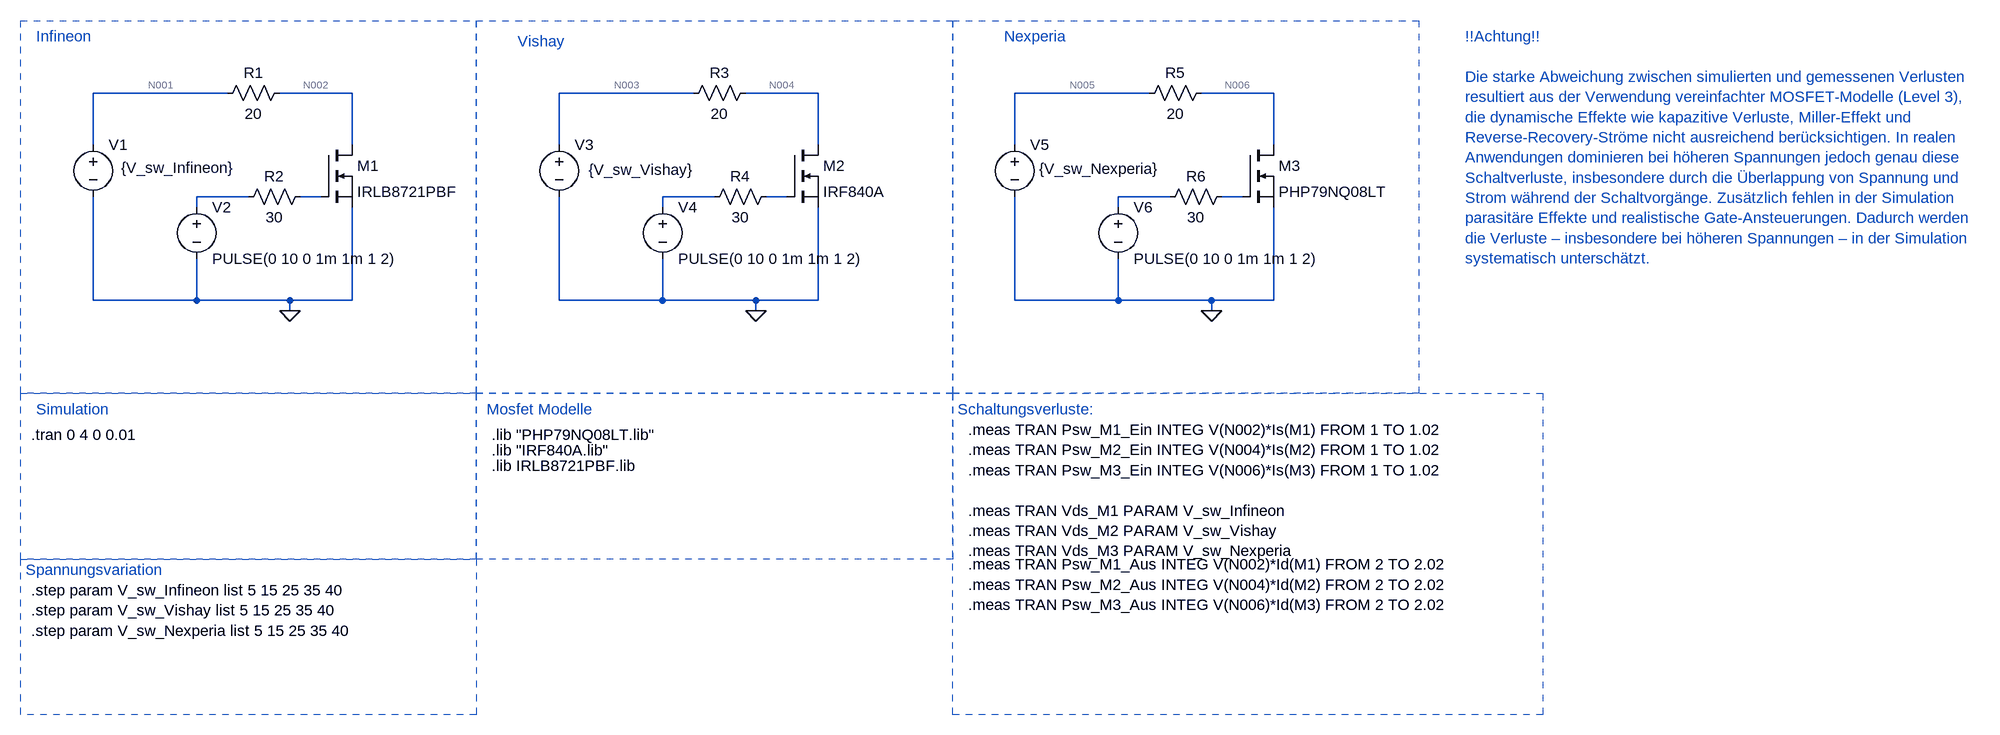
[diagram p0: schematic Messprojekt.asc]
Messprojekt.asc, the LTspice schematic file:
Version 4
SHEET 1 9504 1040
WIRE -208 -192 -416 -192
WIRE -16 -192 -128 -192
WIRE 512 -192 304 -192
WIRE 704 -192 592 -192
WIRE 1216 -192 1008 -192
WIRE 1408 -192 1296 -192
WIRE -416 -112 -416 -192
WIRE -16 -112 -16 -192
WIRE 304 -112 304 -192
WIRE 704 -112 704 -192
WIRE 1008 -112 1008 -192
WIRE 1408 -112 1408 -192
WIRE -176 -32 -256 -32
WIRE -64 -32 -96 -32
WIRE 544 -32 464 -32
WIRE 656 -32 624 -32
WIRE 1248 -32 1168 -32
WIRE 1360 -32 1328 -32
WIRE -256 -16 -256 -32
WIRE 464 -16 464 -32
WIRE 1168 -16 1168 -32
WIRE -416 128 -416 -32
WIRE -256 128 -256 64
WIRE -256 128 -416 128
WIRE -112 128 -256 128
WIRE -16 128 -16 -16
WIRE -16 128 -112 128
WIRE 304 128 304 -32
WIRE 464 128 464 64
WIRE 464 128 304 128
WIRE 608 128 464 128
WIRE 704 128 704 -16
WIRE 704 128 608 128
WIRE 1008 128 1008 -32
WIRE 1168 128 1168 64
WIRE 1168 128 1008 128
WIRE 1312 128 1168 128
WIRE 1408 128 1408 -16
WIRE 1408 128 1312 128
WIRE -112 144 -112 128
WIRE 608 144 608 128
WIRE 1312 144 1312 128
FLAG -112 144 0
FLAG 608 144 0
FLAG 1312 144 0
SYMBOL nmos -64 -112 R0
SYMATTR InstName M1
SYMATTR Value IRLB8721PBF
SYMBOL voltage -416 -128 R0
WINDOW 123 0 0 Left 0
WINDOW 39 0 0 Left 0
WINDOW 3 43 51 Left 2
SYMATTR Value {V_sw_Infineon}
SYMATTR InstName V1
SYMBOL voltage -256 -32 R0
WINDOW 123 0 0 Left 0
WINDOW 39 0 0 Left 0
SYMATTR InstName V2
SYMATTR Value PULSE(0 10 0 1m 1m 1 2)
SYMBOL res -112 -208 R90
WINDOW 0 0 56 VBottom 2
WINDOW 3 32 56 VTop 2
SYMATTR InstName R1
SYMATTR Value 20
SYMBOL res -80 -48 R90
WINDOW 0 0 56 VBottom 2
WINDOW 3 32 56 VTop 2
SYMATTR InstName R2
SYMATTR Value 30
SYMBOL nmos 656 -112 R0
SYMATTR InstName M2
SYMATTR Value IRF840A
SYMBOL voltage 304 -128 R0
WINDOW 123 0 0 Left 0
WINDOW 39 0 0 Left 0
WINDOW 3 46 54 Left 2
SYMATTR Value {V_sw_Vishay}
SYMATTR InstName V3
SYMBOL voltage 464 -32 R0
WINDOW 123 0 0 Left 0
WINDOW 39 0 0 Left 0
SYMATTR InstName V4
SYMATTR Value PULSE(0 10 0 1m 1m 1 2)
SYMBOL res 608 -208 R90
WINDOW 0 0 56 VBottom 2
WINDOW 3 32 56 VTop 2
SYMATTR InstName R3
SYMATTR Value 20
SYMBOL res 640 -48 R90
WINDOW 0 0 56 VBottom 2
WINDOW 3 32 56 VTop 2
SYMATTR InstName R4
SYMATTR Value 30
SYMBOL nmos 1360 -112 R0
SYMATTR InstName M3
SYMATTR Value PHP79NQ08LT
SYMBOL voltage 1008 -128 R0
WINDOW 123 0 0 Left 0
WINDOW 39 0 0 Left 0
WINDOW 3 38 53 Left 2
SYMATTR Value {V_sw_Nexperia}
SYMATTR InstName V5
SYMBOL voltage 1168 -32 R0
WINDOW 123 0 0 Left 0
WINDOW 39 0 0 Left 0
SYMATTR InstName V6
SYMATTR Value PULSE(0 10 0 1m 1m 1 2)
SYMBOL res 1312 -208 R90
WINDOW 0 0 56 VBottom 2
WINDOW 3 32 56 VTop 2
SYMATTR InstName R5
SYMATTR Value 20
SYMBOL res 1344 -48 R90
WINDOW 0 0 56 VBottom 2
WINDOW 3 32 56 VTop 2
SYMATTR InstName R6
SYMATTR Value 30
TEXT -512 336 Left 2 !.tran 0 4 0 0.01
TEXT 200 336 Left 2 !.lib "PHP79NQ08LT.lib"
TEXT 200 360 Left 2 !.lib "IRF840A.lib"
TEXT 200 384 Left 2 !.lib IRLB8721PBF.lib
TEXT 240 -272 Left 2 ;Vishay
TEXT 992 -280 Left 2 ;Nexperia
TEXT -504 -280 Left 2 ;Infineon
TEXT -504 296 Left 2 ;Simulation
TEXT 192 296 Left 2 ;Mosfet Modelle
TEXT 920 296 Left 2 ;Schaltungsverluste:
TEXT -520 544 Left 2 ;Spannungsvariation
TEXT -512 576 Left 2 !.step param V_sw_Infineon list 5 15 25 35 40\n.step param V_sw_Vishay list 5 15 25 35 40\n.step param V_sw_Nexperia list 5 15 25 35 40
TEXT 936 328 Left 2 !.meas TRAN Psw_M1_Ein INTEG V(N002)*Is(M1) FROM 1 TO 1.02\n.meas TRAN Psw_M2_Ein INTEG V(N004)*Is(M2) FROM 1 TO 1.02\n.meas TRAN Psw_M3_Ein INTEG V(N006)*Is(M3) FROM 1 TO 1.02\n \n.meas TRAN Vds_M1 PARAM V_sw_Infineon\n.meas TRAN Vds_M2 PARAM V_sw_Vishay\n.meas TRAN Vds_M3 PARAM V_sw_Nexperia
TEXT 936 536 Left 2 !.meas TRAN Psw_M1_Aus INTEG V(N002)*Id(M1) FROM 2 TO 2.02\n.meas TRAN Psw_M2_Aus INTEG V(N004)*Id(M2) FROM 2 TO 2.02\n.meas TRAN Psw_M3_Aus INTEG V(N006)*Id(M3) FROM 2 TO 2.02
TEXT 1704 -280 Left 2 ;!!Achtung!!\n \nDie starke Abweichung zwischen simulierten und gemessenen Verlusten \nresultiert aus der Verwendung vereinfachter MOSFET-Modelle (Level 3), \ndie dynamische Effekte wie kapazitive Verluste, Miller-Effekt und \nReverse-Recovery-Ströme nicht ausreichend berücksichtigen. In realen \nAnwendungen dominieren bei höheren Spannungen jedoch genau diese \nSchaltverluste, insbesondere durch die Überlappung von Spannung und \nStrom während der Schaltvorgänge. Zusätzlich fehlen in der Simulation \nparasitäre Effekte und realistische Gate-Ansteuerungen. Dadurch werden \ndie Verluste – insbesondere bei höheren Spannungen – in der Simulation \nsystematisch unterschätzt.
RECTANGLE Normal 912 272 176 -304 2
RECTANGLE Normal 176 272 -528 -304 2
RECTANGLE Normal 1632 272 912 -304 2
RECTANGLE Normal 176 528 -528 272 2
RECTANGLE Normal 912 528 176 272 2
RECTANGLE Normal 176 768 -528 528 2
RECTANGLE Normal 1824 768 912 272 2

The netlist it stands for:
* Messprojekt.asc
M1 N002 N008 0 0 IRLB8721PBF
V1 N001 0 {V_sw_Infineon}
V2 N007 0 PULSE(0 10 0 1m 1m 1 2)
R1 N002 N001 20
R2 N008 N007 30
M2 N004 N010 0 0 IRF840A
V3 N003 0 {V_sw_Vishay}
V4 N009 0 PULSE(0 10 0 1m 1m 1 2)
R3 N004 N003 20
R4 N010 N009 30
M3 N006 N012 0 0 PHP79NQ08LT
V5 N005 0 {V_sw_Nexperia}
V6 N011 0 PULSE(0 10 0 1m 1m 1 2)
R5 N006 N005 20
R6 N012 N011 30
.model NMOS NMOS
.model PMOS PMOS
.lib standard.mos
.tran 0 4 0 0.01
.lib "PHP79NQ08LT.lib"
.lib "IRF840A.lib"
.lib IRLB8721PBF.lib
* Vishay
* Nexperia
* Infineon
* Simulation
* Mosfet Modelle
* Schaltungsverluste:
* Spannungsvariation
.step param V_sw_Infineon list 5 15 25 35 40
.step param V_sw_Vishay list 5 15 25 35 40
.step param V_sw_Nexperia list 5 15 25 35 40
.meas TRAN Psw_M1_Ein INTEG V(N002)*Is(M1) FROM 1 TO 1.02
.meas TRAN Psw_M2_Ein INTEG V(N004)*Is(M2) FROM 1 TO 1.02
.meas TRAN Psw_M3_Ein INTEG V(N006)*Is(M3) FROM 1 TO 1.02
.meas TRAN Vds_M1 PARAM V_sw_Infineon
.meas TRAN Vds_M2 PARAM V_sw_Vishay
.meas TRAN Vds_M3 PARAM V_sw_Nexperia
.meas TRAN Psw_M1_Aus INTEG V(N002)*Id(M1) FROM 2 TO 2.02
.meas TRAN Psw_M2_Aus INTEG V(N004)*Id(M2) FROM 2 TO 2.02
.meas TRAN Psw_M3_Aus INTEG V(N006)*Id(M3) FROM 2 TO 2.02
* !!Achtung!!
* Die starke Abweichung zwischen simulierten und gemessenen Verlusten
* resultiert aus der Verwendung vereinfachter MOSFET-Modelle (Level 3),
* die dynamische Effekte wie kapazitive Verluste, Miller-Effekt und
* Reverse-Recovery-Ströme nicht ausreichend berücksichtigen. In realen
* Anwendungen dominieren bei höheren Spannungen jedoch genau diese
* Schaltverluste, insbesondere durch die Überlappung von Spannung und
* Strom während der Schaltvorgänge. Zusätzlich fehlen in der Simulation
* parasitäre Effekte und realistische Gate-Ansteuerungen. Dadurch werden
* die Verluste – insbesondere bei höheren Spannungen – in der Simulation
* systematisch unterschätzt.
.backanno
.end

* Results of the author's LTspice run, read from the files saved beside the schematic
* Operating Point (first step), zero values left out:
*   v_sw_infineon = 5 
*   V(n002) = 5 V
*   V(n001) = 5 V
*   V(n004) = 226.7 mV
*   V(n003) = 5 V
*   V(n006) = 28.34 mV
*   V(n005) = 5 V
*   Id(M1) = 8.882 pA
*   Ib(M1) = -5.01 pA
*   Is(M1) = -5 pA
*   Id(M2) = 238.7 mA
*   Is(M2) = -238.7 mA
*   Id(M3) = 248.6 mA
*   Is(M3) = -248.6 mA
*   I(R1) = -7.889 pA
*   I(R3) = -238.7 mA
*   I(R5) = -248.6 mA
*   I(V1) = -7.889 pA
*   I(V3) = -238.7 mA
*   I(V5) = -248.6 mA
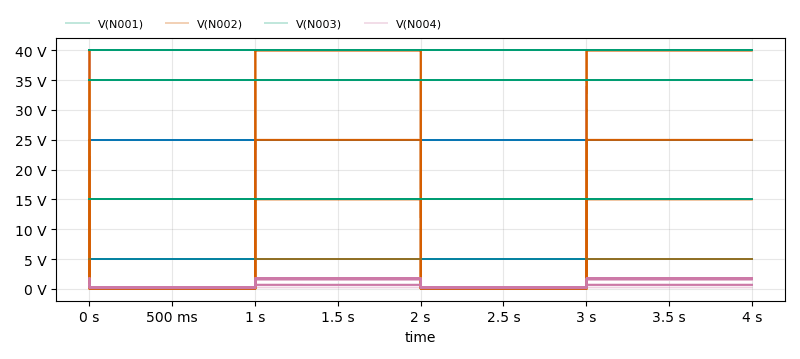
[diagram p1: Transient Analysis of Messprojekt.asc, plotted from the saved traces]
* Transient Analysis, 125 runs:
*   V(N001) [run 1]: min 5 V, max 5 V, average 5 V, rms 5 V, last 5 V
*   V(N001) [run 2]: min 35 V, max 35 V, average 35 V, rms 35 V, last 35 V
*   V(N001) [run 3]: min 15 V, max 15 V, average 15 V, rms 15 V, last 15 V
*   V(N001) [run 4]: min 40 V, max 40 V, average 40 V, rms 40 V, last 40 V
*   V(N001) [run 5]: min 35 V, max 35 V, average 35 V, rms 35 V, last 35 V
*   V(N001) [run 6]: min 15 V, max 15 V, average 15 V, rms 15 V, last 15 V
*   V(N001) [run 7]: min 40 V, max 40 V, average 40 V, rms 40 V, last 40 V
*   V(N001) [run 8]: min 25 V, max 25 V, average 25 V, rms 25 V, last 25 V
*   V(N002) [run 1]: min 1.588 mV, max 5 V, average 2.497 V, rms 3.533 V, last 5 V
*   V(N002) [run 2]: min 11.12 mV, max 35 V, average 17.48 V, rms 24.73 V, last 35 V
*   V(N002) [run 3]: min 4.766 mV, max 15 V, average 7.492 V, rms 10.6 V, last 15 V
*   V(N002) [run 4]: min 12.71 mV, max 40 V, average 19.98 V, rms 28.26 V, last 40 V
*   V(N002) [run 5]: min 11.12 mV, max 35 V, average 17.48 V, rms 24.73 V, last 35 V
*   V(N002) [run 6]: min 4.766 mV, max 15 V, average 7.492 V, rms 10.6 V, last 15 V
*   V(N002) [run 7]: min 12.71 mV, max 40 V, average 19.98 V, rms 28.26 V, last 40 V
*   V(N002) [run 8]: min 7.944 mV, max 25 V, average 12.49 V, rms 17.66 V, last 25 V
*   V(N003) [run 1]: min 5 V, max 5 V, average 5 V, rms 5 V, last 5 V
*   V(N003) [run 2]: min 15 V, max 15 V, average 15 V, rms 15 V, last 15 V
*   V(N003) [run 3]: min 35 V, max 35 V, average 35 V, rms 35 V, last 35 V
*   V(N003) [run 4]: min 40 V, max 40 V, average 40 V, rms 40 V, last 40 V
*   V(N003) [run 5]: min 15 V, max 15 V, average 15 V, rms 15 V, last 15 V
*   V(N003) [run 6]: min 35 V, max 35 V, average 35 V, rms 35 V, last 35 V
*   V(N003) [run 7]: min 40 V, max 40 V, average 40 V, rms 40 V, last 40 V
*   V(N003) [run 8]: min 15 V, max 15 V, average 15 V, rms 15 V, last 15 V
*   V(N004) [run 1]: min 34.02 mV, max 226.7 mV, average 130.3 mV, rms 162 mV, last 226.7 mV
*   V(N004) [run 2]: min 102.2 mV, max 680.2 mV, average 390.9 mV, rms 486.1 mV, last 680.2 mV
*   V(N004) [run 3]: min 239 mV, max 1.587 V, average 912.3 mV, rms 1.134 V, last 1.587 V
*   V(N004) [run 4]: min 273.3 mV, max 1.814 V, average 1.043 V, rms 1.296 V, last 1.814 V
*   V(N004) [run 5]: min 102.2 mV, max 680.2 mV, average 390.9 mV, rms 486.1 mV, last 680.2 mV
*   V(N004) [run 6]: min 239 mV, max 1.587 V, average 912.3 mV, rms 1.134 V, last 1.587 V
*   V(N004) [run 7]: min 273.3 mV, max 1.814 V, average 1.043 V, rms 1.296 V, last 1.814 V
*   V(N004) [run 8]: min 102.2 mV, max 680.2 mV, average 390.9 mV, rms 486.1 mV, last 680.2 mV
* From the log:
*   Measurement: psw_m1_ein
*     step  INTEG(v(n002)*is(m1))  FROM  TO
*        1  -0.000103439  1  1.02
*        2  -0.00095244  1  1.02
*        3  -0.00260996  1  1.02
*        4  -0.00509797  1  1.02
*        5  -0.00665118  1  1.02
*        6  -5.39616e-06  1  1.02
*        7  -5.11449e-05  1  1.02
*        8  -0.000168798  1  1.02
*        9  -0.000340199  1  1.02
*       10  -0.000489639  1  1.02
*       11  -4.33147e-05  1  1.02
*       12  -0.000320972  1  1.02
*       13  -0.000888885  1  1.02
*       14  -0.00153552  1  1.02
*       15  -0.00234387  1  1.02
*       16  -3.06899e-05  1  1.02
*       17  -0.000257637  1  1.02
*       18  -0.000708694  1  1.02
*       19  -0.00136799  1  1.02
*       20  -0.0017021  1  1.02
*       21  -2.61164e-05  1  1.02
*       22  -0.000228142  1  1.02
*       23  -0.0006397  1  1.02
*       24  -0.00129461  1  1.02
*       25  -0.00145989  1  1.02
*       26  -0.000103439  1  1.02
*       27  -0.00095244  1  1.02
*       28  -0.00260996  1  1.02
*       29  -0.00509797  1  1.02
*       30  -0.00665118  1  1.02
*       31  -5.39616e-06  1  1.02
*       32  -5.11449e-05  1  1.02
*       33  -0.000168798  1  1.02
*       34  -0.000340199  1  1.02
*       35  -0.000489639  1  1.02
*       36  -4.33147e-05  1  1.02
*       37  -0.000320972  1  1.02
*       38  -0.000888885  1  1.02
*       39  -0.00153552  1  1.02
*       40  -0.00234387  1  1.02
*     ...
*   Measurement: psw_m2_ein
*     step  INTEG(v(n004)*is(m2))  FROM  TO
*        1  -0.00101124  1  1.02
*        2  -0.00101102  1  1.02
*        3  -0.0010111  1  1.02
*        4  -0.00101113  1  1.02
*        5  -0.00101114  1  1.02
*        6  -0.00912397  1  1.02
*        7  -0.00912357  1  1.02
*        8  -0.00912315  1  1.02
*        9  -0.00912275  1  1.02
*       10  -0.00912255  1  1.02
*       11  -0.0252988  1  1.02
*       12  -0.0252892  1  1.02
*       13  -0.0252868  1  1.02
*       14  -0.025251  1  1.02
*       15  -0.0252848  1  1.02
*       16  -0.0495008  1  1.02
*       17  -0.0495079  1  1.02
*       18  -0.049509  1  1.02
*       19  -0.0495103  1  1.02
*       20  -0.0495218  1  1.02
*       21  -0.0647495  1  1.02
*       22  -0.0647525  1  1.02
*       23  -0.0647518  1  1.02
*       24  -0.0647478  1  1.02
*       25  -0.0647561  1  1.02
*       26  -0.00101124  1  1.02
*       27  -0.00101102  1  1.02
*       28  -0.0010111  1  1.02
*       29  -0.00101113  1  1.02
*       30  -0.00101114  1  1.02
*       31  -0.00912397  1  1.02
*       32  -0.00912357  1  1.02
*       33  -0.00912315  1  1.02
*       34  -0.00912275  1  1.02
*       35  -0.00912255  1  1.02
*       36  -0.0252988  1  1.02
*       37  -0.0252892  1  1.02
*       38  -0.0252868  1  1.02
*       39  -0.025251  1  1.02
*       40  -0.0252848  1  1.02
*     ...
*   Measurement: psw_m3_ein
*     step  INTEG(v(n006)*is(m3))  FROM  TO
*        1  -0.000139699  1  1.02
*        2  -0.000139699  1  1.02
*        3  -0.000139699  1  1.02
*        4  -0.0001397  1  1.02
*        5  -0.0001397  1  1.02
*        6  -0.000139675  1  1.02
*        7  -0.000139678  1  1.02
*        8  -0.000139679  1  1.02
*        9  -0.000139679  1  1.02
*       10  -0.000139675  1  1.02
*       11  -0.000139674  1  1.02
*       12  -0.000139674  1  1.02
*       13  -0.000139674  1  1.02
*       14  -0.000139671  1  1.02
*       15  -0.000139674  1  1.02
*       16  -0.000139672  1  1.02
*       17  -0.000139672  1  1.02
*       18  -0.000139672  1  1.02
*       19  -0.000139671  1  1.02
*       20  -0.000139672  1  1.02
*       21  -0.000139675  1  1.02
*       22  -0.000139675  1  1.02
*       23  -0.000139675  1  1.02
*       24  -0.000139675  1  1.02
*       25  -0.000139674  1  1.02
*       26  -0.00125731  1  1.02
*       27  -0.00125731  1  1.02
*       28  -0.00125732  1  1.02
*       29  -0.00125732  1  1.02
*       30  -0.00125732  1  1.02
*       31  -0.0012571  1  1.02
*       32  -0.00125713  1  1.02
*       33  -0.00125713  1  1.02
*       34  -0.00125713  1  1.02
*       35  -0.0012571  1  1.02
*       36  -0.00125709  1  1.02
*       37  -0.00125709  1  1.02
*       38  -0.00125709  1  1.02
*       39  -0.00125706  1  1.02
*       40  -0.00125709  1  1.02
*     ...
*   Measurement: vds_m1
*     step  v_sw_infineon
*        1  5
*        2  15
*        3  25
*        4  35
*        5  40
*        6  5
*        7  15
*        8  25
*        9  35
*       10  40
*       11  5
*       12  15
*       13  25
*       14  35
*       15  40
*       16  5
*       17  15
*       18  25
*       19  35
*       20  40
*       21  5
*       22  15
*       23  25
*       24  35
*       25  40
*       26  5
*       27  15
*       28  25
*       29  35
*       30  40
*       31  5
*       32  15
*       33  25
*       34  35
*       35  40
*       36  5
*       37  15
*       38  25
*       39  35
*       40  40
*     ...
*   Measurement: vds_m2
*     step  v_sw_vishay
*        1  5
*        2  5
*        3  5
*        4  5
*        5  5
*        6  15
*        7  15
*        8  15
*        9  15
*       10  15
*       11  25
*       12  25
*       13  25
*       14  25
*       15  25
*       16  35
*       17  35
*       18  35
*       19  35
*       20  35
*       21  40
*       22  40
*       23  40
*       24  40
*       25  40
*       26  5
*       27  5
*       28  5
*       29  5
*       30  5
*       31  15
*       32  15
*       33  15
*       34  15
*       35  15
*       36  25
*       37  25
*       38  25
*       39  25
*       40  25
*     ...
*   Measurement: vds_m3
*     step  v_sw_nexperia
*        1  5
*        2  5
*        3  5
*        4  5
*        5  5
*        6  5
*        7  5
*        8  5
*        9  5
*       10  5
*       11  5
*       12  5
*       13  5
*       14  5
*       15  5
*       16  5
*       17  5
*       18  5
*       19  5
*       20  5
*       21  5
*       22  5
*       23  5
*       24  5
*       25  5
*       26  15
*       27  15
*       28  15
*       29  15
*       30  15
*       31  15
*       32  15
*       33  15
*       34  15
*       35  15
*       36  15
*       37  15
*       38  15
*       39  15
*       40  15
*     ...
*   Measurement: psw_m1_aus
*     step  INTEG(v(n002)*id(m1))  FROM  TO
*        1  1.77821e-05  2  2.02
*        2  0.000155968  2  2.02
*        3  0.000533005  2  2.02
*        4  0.001499  2  2.02
*        5  0.00269067  2  2.02
*        6  1.56634e-05  2  2.02
*        7  0.00013379  2  2.02
*        8  0.000454751  2  2.02
*        9  0.000940291  2  2.02
*       10  0.001128  2  2.02
*       11  2.21823e-05  2  2.02
*       12  0.000140503  2  2.02
*       13  0.000399845  2  2.02
*       14  0.000885231  2  2.02
*       15  0.00111847  2  2.02
*       16  1.32307e-05  2  2.02
*       17  0.000191956  2  2.02
*       18  0.000332495  2  2.02
*       19  0.000751541  2  2.02
*       20  0.00140826  2  2.02
*       21  1.09413e-05  2  2.02
*       22  0.000166344  2  2.02
*       23  0.000460703  2  2.02
*       24  0.00088946  2  2.02
*       25  0.0011748  2  2.02
*       26  1.77821e-05  2  2.02
*       27  0.000155968  2  2.02
*       28  0.000533005  2  2.02
*       29  0.001499  2  2.02
*       30  0.00269067  2  2.02
*       31  1.56634e-05  2  2.02
*       32  0.00013379  2  2.02
*       33  0.000454751  2  2.02
*       34  0.000940291  2  2.02
*       35  0.001128  2  2.02
*       36  2.21823e-05  2  2.02
*       37  0.000140503  2  2.02
*       38  0.000399845  2  2.02
*       39  0.000885231  2  2.02
*       40  0.00111847  2  2.02
*     ...
*   Measurement: psw_m2_aus
*     step  INTEG(v(n004)*id(m2))  FROM  TO
*        1  0.000186955  2  2.02
*        2  0.000186823  2  2.02
*        3  0.000186902  2  2.02
*        4  0.000186854  2  2.02
*        5  0.00018674  2  2.02
*        6  0.00168604  2  2.02
*        7  0.00168596  2  2.02
*        8  0.00168714  2  2.02
*        9  0.00168743  2  2.02
*       10  0.00168745  2  2.02
*       11  0.00469861  2  2.02
*       12  0.00470164  2  2.02
*       13  0.00470101  2  2.02
*       14  0.00469855  2  2.02
*       15  0.00469848  2  2.02
*       16  0.00923484  2  2.02
*       17  0.0092373  2  2.02
*       18  0.00923371  2  2.02
*       19  0.00923543  2  2.02
*       20  0.00923716  2  2.02
*       21  0.0120774  2  2.02
*       22  0.0120825  2  2.02
*       23  0.0120842  2  2.02
*       24  0.0120836  2  2.02
*       25  0.0120838  2  2.02
*       26  0.000186955  2  2.02
*       27  0.000186823  2  2.02
*       28  0.000186902  2  2.02
*       29  0.000186854  2  2.02
*       30  0.00018674  2  2.02
*       31  0.00168604  2  2.02
*       32  0.00168596  2  2.02
*       33  0.00168714  2  2.02
*       34  0.00168743  2  2.02
*       35  0.00168745  2  2.02
*       36  0.00469861  2  2.02
*       37  0.00470164  2  2.02
*       38  0.00470101  2  2.02
*       39  0.00469855  2  2.02
*       40  0.00469848  2  2.02
*     ...
*   Measurement: psw_m3_aus
*     step  INTEG(v(n006)*id(m3))  FROM  TO
*        1  0.000126477  2  2.02
*        2  0.000126474  2  2.02
*        3  0.000126475  2  2.02
*        4  0.000126477  2  2.02
*        5  0.000126477  2  2.02
*        6  0.000126476  2  2.02
*        7  0.000126475  2  2.02
*        8  0.000126477  2  2.02
*        9  0.000126477  2  2.02
*       10  0.000126477  2  2.02
*       11  0.000126475  2  2.02
*       12  0.000126477  2  2.02
*       13  0.000126477  2  2.02
*       14  0.000126475  2  2.02
*       15  0.000126475  2  2.02
*       16  0.000126473  2  2.02
*       17  0.000126474  2  2.02
*       18  0.000126473  2  2.02
*       19  0.000126473  2  2.02
*       20  0.000126474  2  2.02
*       21  0.000126471  2  2.02
*       22  0.000126472  2  2.02
*       23  0.000126472  2  2.02
*       24  0.000126472  2  2.02
*       25  0.000126472  2  2.02
*       26  0.00113836  2  2.02
*       27  0.00113833  2  2.02
*       28  0.00113835  2  2.02
*       29  0.00113836  2  2.02
*       30  0.00113836  2  2.02
*       31  0.00113835  2  2.02
*       32  0.00113834  2  2.02
*       33  0.00113836  2  2.02
*       34  0.00113836  2  2.02
*       35  0.00113836  2  2.02
*       36  0.00113835  2  2.02
*       37  0.00113836  2  2.02
*       38  0.00113836  2  2.02
*       39  0.00113835  2  2.02
*       40  0.00113835  2  2.02
*     ...